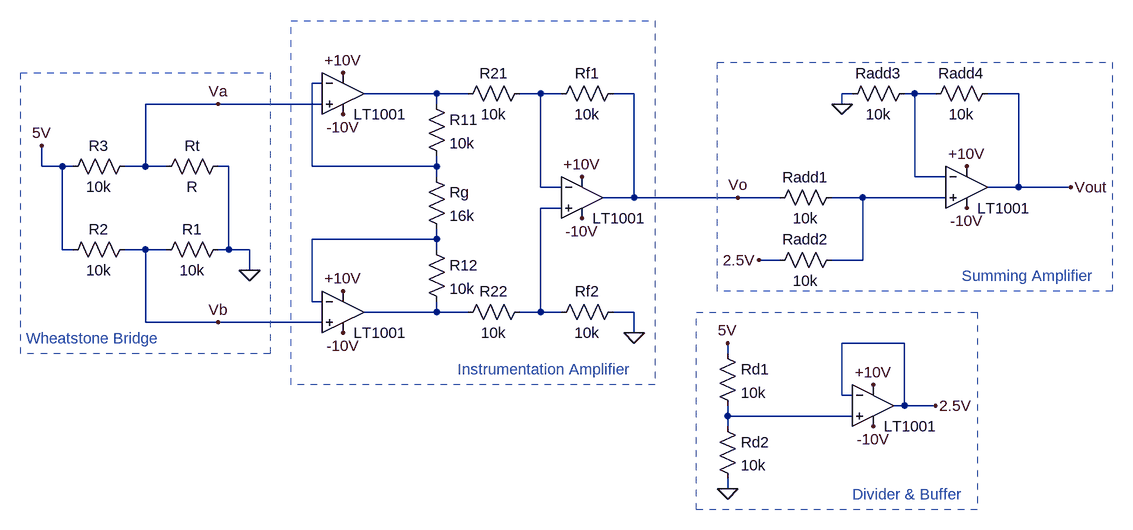
[diagram p0: schematic Instrumentation Amplifier - Print.asc]
Instrumentation Amplifier - Print.asc, the LTspice schematic file:
Version 4
SHEET 1 880 704
WIRE -896 0 -912 0
WIRE -720 16 -832 16
WIRE -672 16 -720 16
WIRE -560 16 -592 16
WIRE -528 16 -560 16
WIRE -416 16 -448 16
WIRE -80 16 -96 16
WIRE 16 16 0 16
WIRE 48 16 16 16
WIRE 176 16 128 16
WIRE -1056 32 -1168 32
WIRE -896 32 -1056 32
WIRE -720 32 -720 16
WIRE -96 32 -96 16
WIRE -1328 128 -1328 96
WIRE -1296 128 -1328 128
WIRE -1280 128 -1296 128
WIRE -1168 128 -1168 32
WIRE -1168 128 -1200 128
WIRE -1136 128 -1168 128
WIRE -1040 128 -1056 128
WIRE -912 128 -912 0
WIRE -720 128 -720 112
WIRE -720 128 -912 128
WIRE -720 144 -720 128
WIRE 16 144 16 16
WIRE 64 144 16 144
WIRE -560 160 -560 16
WIRE -528 160 -560 160
WIRE 176 160 176 16
WIRE 176 160 128 160
WIRE 256 160 176 160
WIRE -416 176 -416 16
WIRE -416 176 -464 176
WIRE -256 176 -416 176
WIRE -192 176 -256 176
WIRE -64 176 -112 176
WIRE 64 176 -64 176
WIRE -528 192 -560 192
WIRE -720 240 -720 224
WIRE -720 240 -912 240
WIRE -1296 256 -1296 128
WIRE -1280 256 -1296 256
WIRE -1168 256 -1200 256
WIRE -1136 256 -1168 256
WIRE -1040 256 -1040 128
WIRE -1040 256 -1056 256
WIRE -1008 256 -1040 256
WIRE -720 256 -720 240
WIRE -192 272 -224 272
WIRE -64 272 -64 176
WIRE -64 272 -112 272
WIRE -1008 288 -1008 256
WIRE -912 336 -912 240
WIRE -896 336 -912 336
WIRE -720 352 -720 336
WIRE -720 352 -832 352
WIRE -672 352 -720 352
WIRE -560 352 -560 192
WIRE -560 352 -592 352
WIRE -528 352 -560 352
WIRE -416 352 -448 352
WIRE -1168 368 -1168 256
WIRE -1056 368 -1168 368
WIRE -896 368 -1056 368
WIRE -416 384 -416 352
WIRE 0 400 -96 400
WIRE -272 416 -272 400
WIRE -96 480 -96 400
WIRE -80 480 -96 480
WIRE 0 496 0 400
WIRE 0 496 -16 496
WIRE 48 496 0 496
WIRE -272 512 -272 496
WIRE -80 512 -272 512
WIRE -272 528 -272 512
WIRE -272 624 -272 608
FLAG -416 384 0
FLAG -864 -16 +10V
FLAG -272 624 0
FLAG 48 496 2.5V
FLAG -224 272 2.5V
FLAG -96 32 0
FLAG -272 400 5V
FLAG -1328 96 5V
FLAG -1008 288 0
FLAG -1056 32 Va
FLAG -1056 368 Vb
FLAG -256 176 Vo
FLAG 256 160 Vout
FLAG -864 320 +10V
FLAG -496 144 +10V
FLAG -48 464 +10V
FLAG 96 128 +10V
FLAG -496 208 -10V
FLAG -864 48 -10V
FLAG -864 384 -10V
FLAG 96 192 -10V
FLAG -48 528 -10V
SYMBOL res -736 16 R0
SYMATTR InstName R11
SYMATTR Value 10k
SYMBOL res -736 128 R0
SYMATTR InstName Rg
SYMATTR Value 16k
SYMBOL res -736 240 R0
SYMATTR InstName R12
SYMATTR Value 10k
SYMBOL res -432 0 R90
WINDOW 0 0 56 VBottom 2
WINDOW 3 32 56 VTop 2
SYMATTR InstName Rf1
SYMATTR Value 10k
SYMBOL res -432 336 R90
WINDOW 0 0 56 VBottom 2
WINDOW 3 32 56 VTop 2
SYMATTR InstName Rf2
SYMATTR Value 10k
SYMBOL res -576 0 R90
WINDOW 0 0 56 VBottom 2
WINDOW 3 32 56 VTop 2
SYMATTR InstName R21
SYMATTR Value 10k
SYMBOL res -576 336 R90
WINDOW 0 0 56 VBottom 2
WINDOW 3 32 56 VTop 2
SYMATTR InstName R22
SYMATTR Value 10k
SYMBOL Opamps\\LT1001 -864 -48 R0
WINDOW 0 16 32 Invisible 2
SYMATTR InstName U1
SYMBOL Opamps\\LT1001 -864 288 R0
WINDOW 0 16 32 Invisible 2
SYMATTR InstName U2
SYMBOL Opamps\\LT1001 -496 112 R0
WINDOW 0 16 32 Invisible 2
SYMATTR InstName U3
SYMBOL res -288 400 R0
SYMATTR InstName Rd1
SYMATTR Value 10k
SYMBOL res -288 512 R0
SYMATTR InstName Rd2
SYMATTR Value 10k
SYMBOL Opamps\\LT1001 -48 432 R0
WINDOW 0 16 32 Invisible 2
SYMATTR InstName U4
SYMBOL res -96 160 R90
WINDOW 0 0 56 VBottom 2
WINDOW 3 32 56 VTop 2
SYMATTR InstName Radd1
SYMATTR Value 10k
SYMBOL res -96 256 R90
WINDOW 0 0 56 VBottom 2
WINDOW 3 32 56 VTop 2
SYMATTR InstName Radd2
SYMATTR Value 10k
SYMBOL Opamps\\LT1001 96 96 R0
WINDOW 0 16 32 Invisible 2
SYMATTR InstName U5
SYMBOL res 16 0 R90
WINDOW 0 0 56 VBottom 2
WINDOW 3 32 56 VTop 2
SYMATTR InstName Radd3
SYMATTR Value 10k
SYMBOL res 144 0 R90
WINDOW 0 0 56 VBottom 2
WINDOW 3 32 56 VTop 2
SYMATTR InstName Radd4
SYMATTR Value 10k
SYMBOL res -1040 240 R90
WINDOW 0 0 56 VBottom 2
WINDOW 3 32 56 VTop 2
SYMATTR InstName R1
SYMATTR Value 10k
SYMBOL res -1184 112 R90
WINDOW 0 0 56 VBottom 2
WINDOW 3 32 56 VTop 2
SYMATTR InstName R3
SYMATTR Value 10k
SYMBOL res -1184 240 R90
WINDOW 0 0 56 VBottom 2
WINDOW 3 32 56 VTop 2
SYMATTR InstName R2
SYMATTR Value 10k
SYMBOL res -1040 112 R90
WINDOW 0 0 56 VBottom 2
WINDOW 3 32 56 VTop 2
SYMATTR InstName Rt
TEXT -1352 392 Left 2 ;Wheatstone Bridge
TEXT -688 440 Left 2 ;Instrumentation Amplifier
TEXT 88 296 Left 2 ;Summing Amplifier
TEXT -80 632 Left 2 ;Divider & Buffer
RECTANGLE Normal -976 416 -1360 -16 2
RECTANGLE Normal -384 464 -944 -96 2
RECTANGLE Normal 112 656 -320 352 2
RECTANGLE Normal 320 320 -288 -32 2

The netlist it stands for:
* Instrumentation Amplifier - Print.asc
R11 N002 N001 10k
Rg N001 N007 16k
R12 N007 N008 10k
Rf1 Vo N003 10k
Rf2 0 N006 10k
R21 N003 N002 10k
R22 N006 N008 10k
XU1 Va N001 +10V -10V N002 LT1001  ; pins In+ In- V+ V- OUT
XU2 Vb N007 +10V -10V N008 LT1001  ; pins In+ In- V+ V- OUT
XU3 N006 N003 +10V -10V Vo LT1001  ; pins In+ In- V+ V- OUT
Rd1 5V N009 10k
Rd2 N009 0 10k
XU4 N009 2.5V +10V -10V 2.5V LT1001  ; pins In+ In- V+ V- OUT
Radd1 N005 Vo 10k
Radd2 N005 2.5V 10k
XU5 N005 N004 +10V -10V Vout LT1001  ; pins In+ In- V+ V- OUT
Radd3 N004 0 10k
Radd4 Vout N004 10k
R1 0 Vb 10k
R3 Va 5V 10k
R2 Vb 5V 10k
Rt 0 Va R
* Wheatstone Bridge
* Instrumentation Amplifier
* Summing Amplifier
* Divider & Buffer
.lib LTC.lib
.backanno
.end